# EasyEDA schematic SCH_StringShotter_2025-03-04.json
TITLE: Sheet_1; REV: 1.0; Date: 2024-07-15; Sheet: 1/1; Drawn By: quant; Company: Your Company
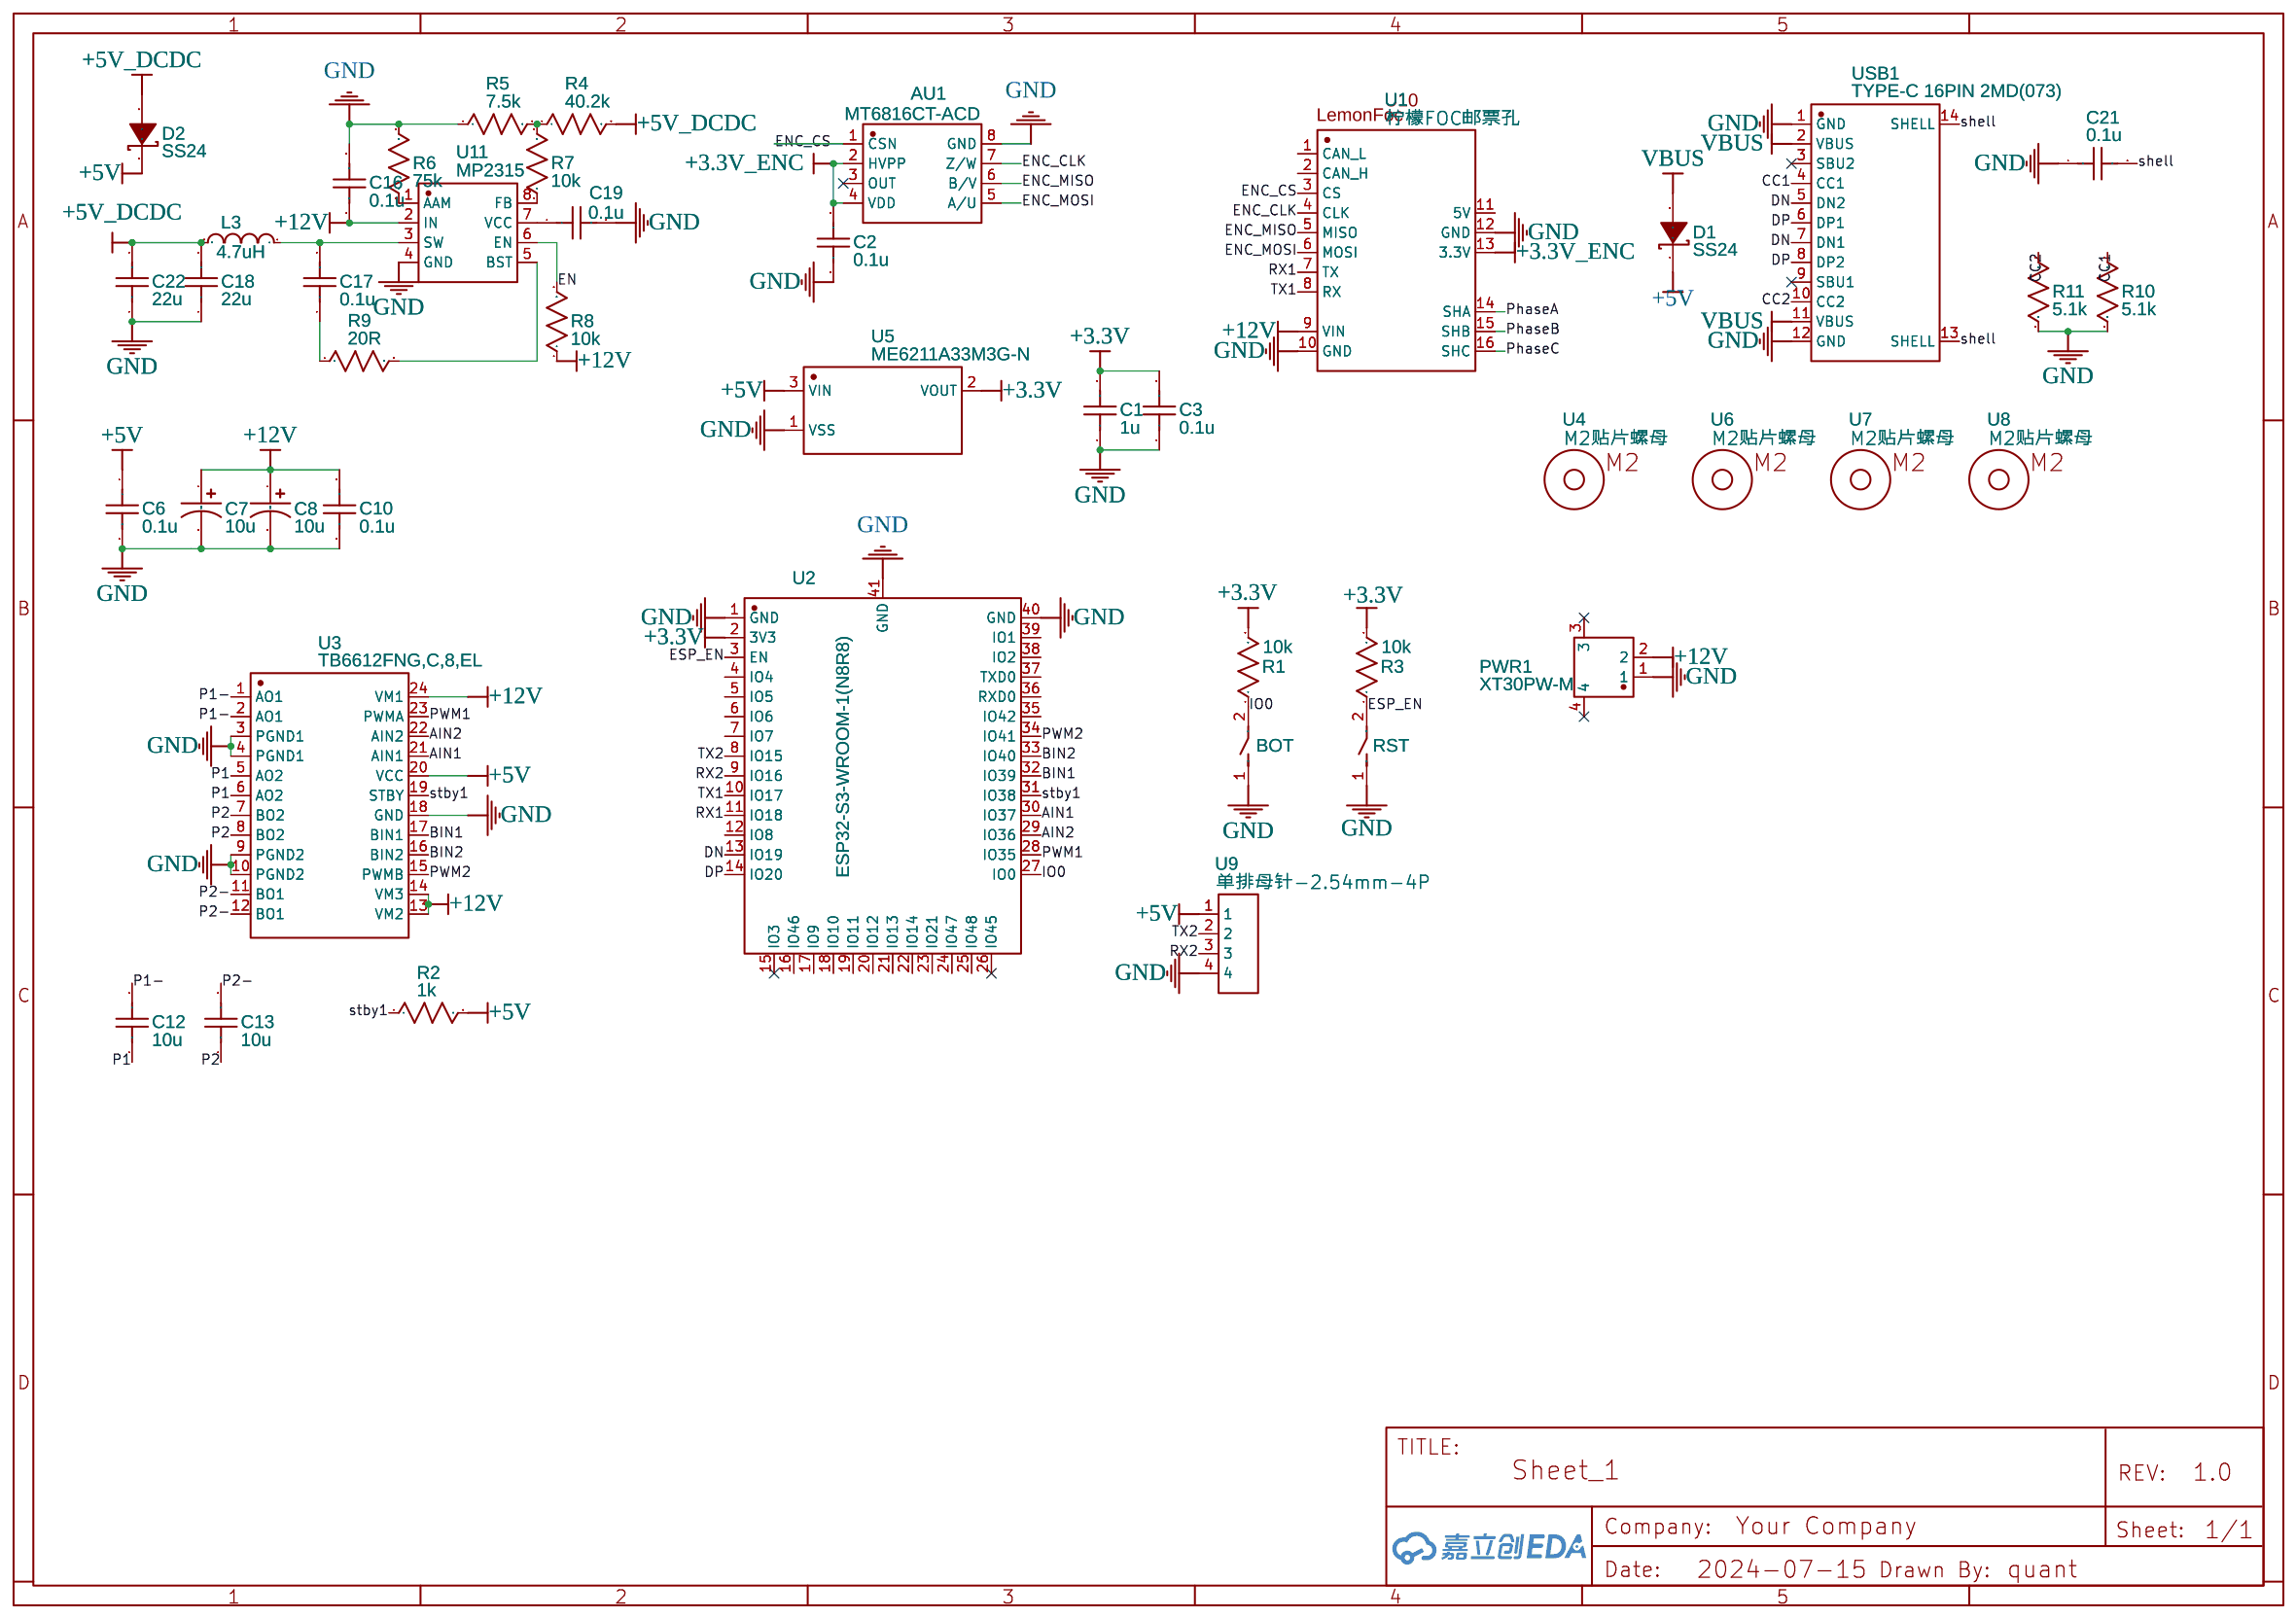
[diagram p0: schematic sheet]

## Parts
AU1  MT6816CT-ACD  [SOP-8_L5.0-W4.0-P1.27-LS6.2-BL]
BOT  TD-1106SN-5.0H-160  [SW-SMD_L6.0-W3.3-LS8.0-1]
C1  1u  [C0603]
C2  0.1u  [C0603]
C3  0.1u  [C0603]
C6  0.1u  [C0603]
C7  10u  [CASE-B_3528]
C8  10u  [CASE-B_3528]
C10  0.1u  [C0603]
C12  10u  [C0805]
C13  10u  [C0805]
C16  0.1u  [C0603]
C17  0.1u  [C0603]
C18  22u  [C1206]
C19  0.1u  [C0603]
C21  0.1u  [C0603]
C22  22u  [C1206]
D1  SS24  [SMA_L4.3-W2.6-LS5.2-RD]
D2  SS24  [SMA_L4.3-W2.6-LS5.2-RD]
L3  4.7uH  [IND-SMD_L7.3-W6.6]
PWR1  XT30PW-M  [CONN-TH_XT30PW-M]
R1  10k  [R0603]
R2  1k  [R0603]
R3  10k  [R0603]
R4  40.2k  [R0603]
R5  7.5k  [R0603]
R6  75k  [R0603]
R7  10k  [R0603]
R8  10k  [R0603]
R9  20R  [R0603]
R10  5.1k  [R0603]
R11  5.1k  [R0603]
RST  TD-1106SN-5.0H-160  [SW-SMD_L6.0-W3.3-LS8.0-1]
U1  柠檬FOC邮票孔  [柠檬FOC邮票孔]
U2  ESP32-S3-WROOM-1(N8R8)  [WIRELM-SMD_ESP32-S3-WROOM-1]
U3  TB6612FNG,C,8,EL  [SSOP-24_L8.3-W5.6-P0.65-LS7.6-BL]
U4  M2贴片螺母  [M2贴片螺母]
U5  ME6211A33M3G-N  [SOT-23-3_L2.9-W1.6-P1.90-LS2.8-BR]
U6  M2贴片螺母  [M2贴片螺母]
U7  M2贴片螺母  [M2贴片螺母]
U8  M2贴片螺母  [M2贴片螺母]
U9  单排母针-2.54mm-4P  [单排母针-2.54MM-4P]
U11  MP2315  [SOT-23-8_L2.9-W1.6-P0.65-LS2.8-BL]
USB1  TYPE-C 16PIN 2MD(073)  [USB-C-SMD_TYPE-C-6PIN-2MD-073]

## Library data of the parts
AU1 = MT6816CT-ACD: Supplier: LCSC; Supplier Part: C879560; Manufacturer: Magn Tek; Contributor: LCSC
BOT RST = TD-1106SN-5.0H-160: Supplier: LCSC; Supplier Part: C2905168; Manufacturer: DEALON(德艺隆); Contributor: LCSC; JLCPCB Part Class: Extended Part
C1-C3 C6 C10 C16 C17 C19 C21 = C_0603_US: Contributor: LCEDA_Lib
C7 C8 = C_Tan_SMD_B_US: Contributor: LCEDA_Lib
C12 C13 = C_0805_US: Contributor: LCEDA_Lib
C18 C22 = C_1206_US: Contributor: LCEDA_Lib
D1 D2 = SS24: Supplier: LCSC; Manufacturer: MDD; Supplier Part: C50645; JLCPCB Part Class: Extended Part
L3 = MHCI06030-5R6M-R8: Supplier: LCSC; Supplier Part: C285710; Manufacturer: Chilisin Elec; Contributor: LCSC; JLCPCB Part Class: Extended Part
PWR1 = XT30PW-M: Supplier: LCSC; Supplier Part: C431092; Manufacturer: Changzhou Amass Elec; Contributor: LCSC; JLCPCB Part Class: Extended Part
R1-R11 = R_0603_US: Contributor: LCEDA_Lib
U1 = 柠檬FOC邮票孔: Supplier: 柠檬树工作室; Contributor: a1804889557
U2 = ESP32-S3-WROOM-1(N8R8): Supplier: LCSC; Supplier Part: C2913201; Manufacturer: ESPRESSIF 乐鑫; Contributor: LCSC
U3 = TB6612FNG,C,8,EL: Contributor: LCSC; Supplier: LCSC; Manufacturer: TOSHIBA(东芝); Supplier Part: C141517; JLCPCB Part Class: Extended Part
U4 U6-U8 = M2贴片螺母: Contributor: voodooli
U5 = ME6211A33M3G-N: Contributor: LCSC; Supplier: LCSC; Manufacturer: MICRONE(南京微盟); Supplier Part: C168807; JLCPCB Part Class: Extended Part
U9 = 单排母针-2.54mm-4P: Manufacturer: 单排母针-2.54mm-6P; Contributor: victory2001
U11 = MP2315: Supplier: LCSC; Supplier Part: C9900008518; Manufacturer: null; Contributor: LCSC; JLCPCB Part Class: Extended Part
USB1 = TYPE-C 16PIN 2MD(073): Supplier: LCSC; Supplier Part: C2765186; Manufacturer: SHOU HAN(首韩); Contributor: LCSC; JLCPCB Part Class: Extended Part

## Nets
+3.3V: C1.2 C3.2 R1.2 R3.2 U2.2(3V3) U5.2(VOUT)
+3.3V_ENC: AU1.2(HVPP) AU1.4(VDD) C2.2 U1.13(3.3V)
+5V: C6.1 D1.1(K) D2.1(K) R2.2 U3.20(VCC) U5.3(VIN) U9.1
+5V_DCDC: C18.2 C22.2 D2.2(A) L3.2 R4.2
+12V: C7.1 C8.1 C10.2 C16.1 PWR1.2 R8.1 U1.9(VIN) U3.13(VM2) U3.14(VM3) U3.24(VM1) U11.2(IN)
GND: AU1.8(GND) BOT.1 C1.1 C2.1 C3.1 C6.2 C7.2 C8.2 C10.1 C16.2 C18.1 C19.2 C21.1 C22.1 PWR1.1 R5.1 R6.2 R10.2 R11.2 RST.1 U1.10(GND) U1.12(GND) U2.1(GND) U2.40(GND) U2.41(GND) U3.3(PGND1) U3.4(PGND1) U3.9(PGND2) U3.10(PGND2) U3.18(GND) U5.1(VSS) U9.4 U11.4(GND) USB1.1(GND) USB1.12(GND)
VBUS: D1.2(A) USB1.2(VBUS) USB1.11(VBUS)
AIN1: U2.30(IO37) U3.21(AIN1)
AIN2: U2.29(IO36) U3.22(AIN2)
BIN1: U2.32(IO39) U3.17(BIN1)
BIN2: U2.33(IO40) U3.16(BIN2)
CC1: R10.1 USB1.4(CC1)
CC2: R11.1 USB1.10(CC2)
DN: U2.13(IO19) USB1.5(DN2) USB1.7(DN1)
DP: U2.14(IO20) USB1.6(DP1) USB1.8(DP2)
EN: R8.2 U11.6(EN)
ENC_CLK: AU1.7(Z/W) U1.4(CLK)
ENC_CS: AU1.1(CSN) U1.3(CS)
ENC_MISO: AU1.6(B/V) U1.5(MISO)
ENC_MOSI: AU1.5(A/U) U1.6(MOSI)
ESP_EN: R3.1 RST.2 U2.3(EN)
IO0: BOT.2 R1.1 U2.27(IO0)
P1: C12.1 U3.5(AO2) U3.6(AO2)
P1-: C12.2 U3.1(AO1) U3.2(AO1)
P2: C13.1 U3.7(BO2) U3.8(BO2)
P2-: C13.2 U3.11(BO1) U3.12(BO1)
PhaseA: U1.14(SHA)
PhaseB: U1.15(SHB)
PhaseC: U1.16(SHC)
PWM1: U2.28(IO35) U3.23(PWMA)
PWM2: U2.34(IO41) U3.15(PWMB)
RX1: U1.7(TX) U2.11(IO18)
RX2: U2.9(IO16) U9.3
shell: C21.2 USB1.13(SHELL) USB1.14(SHELL)
stby1: R2.1 U2.31(IO38) U3.19(STBY)
TX1: U1.8(RX) U2.10(IO17)
TX2: U2.8(IO15) U9.2
Net-(C17-1): C17.1 R9.1
Net-(C17-2): C17.2 L3.1 U11.3(SW)
Net-(C19-1): C19.1 U11.7(VCC)
Net-(R4-1): R4.1 R5.2 R7.2
Net-(R6-1): R6.1 U11.1(AAM)
Net-(R7-1): R7.1 U11.8(FB)
Net-(R9-2): R9.2 U11.5(BST)

Not connected (* = marked no-connect by the designer): AU1 3(OUT)*; PWR1 3* 4*; U1 1(CAN_L) 2(CAN_H) 11(5V); U2 4(IO4) 5(IO5) 6(IO6) 7(IO7) 12(IO8) 15(IO3)* 16(IO46) 17(IO9) 18(IO10) 19(IO11) 20(IO12) 21(IO13) 22(IO14) 23(IO21) 24(IO47) 25(IO48) 26(IO45)* 35(IO42) 36(RXD0) 37(TXD0) 38(IO2) 39(IO1); USB1 3(SBU2)* 9(SBU1)*
